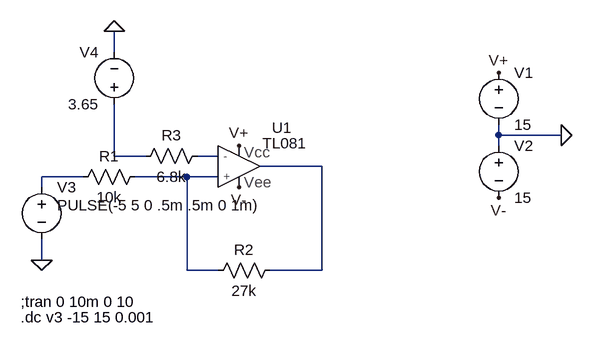
[diagram p0: schematic Biestable - schmitt trigger - NOINV.asc]
Biestable - schmitt trigger - NOINV.asc, the LTspice schematic file:
Version 4
SHEET 1 880 680
WIRE 16 -80 16 -112
WIRE 608 48 608 32
WIRE 704 48 608 48
WIRE 608 64 608 48
WIRE 16 80 16 0
WIRE 64 80 16 80
WIRE 176 80 144 80
WIRE 336 96 240 96
WIRE -32 112 -96 112
WIRE 128 112 48 112
WIRE 176 112 128 112
WIRE -96 128 -96 112
WIRE -96 240 -96 208
WIRE 128 256 128 112
WIRE 176 256 128 256
WIRE 336 256 336 96
WIRE 336 256 256 256
FLAG 208 128 V-
FLAG 704 48 0
FLAG 608 -48 V+
FLAG 608 144 V-
FLAG -96 240 0
FLAG 208 64 V+
FLAG 16 -112 0
SYMBOL Agregados\\TL081 208 96 R0
SYMATTR InstName U1
SYMBOL res 272 240 R90
WINDOW 0 0 56 VBottom 2
WINDOW 3 32 56 VTop 2
SYMATTR InstName R2
SYMATTR Value 27k
SYMBOL res 64 96 R90
WINDOW 0 0 56 VBottom 2
WINDOW 3 32 56 VTop 2
SYMATTR InstName R1
SYMATTR Value 10k
SYMBOL voltage 608 -64 R0
WINDOW 123 0 0 Left 0
WINDOW 39 0 0 Left 0
SYMATTR InstName V1
SYMATTR Value 15
SYMBOL voltage 608 48 R0
WINDOW 123 0 0 Left 0
WINDOW 39 0 0 Left 0
SYMATTR InstName V2
SYMATTR Value 15
SYMBOL voltage -96 112 R0
WINDOW 123 0 0 Left 0
WINDOW 39 0 0 Left 0
WINDOW 3 24 44 Left 2
SYMATTR Value PULSE(-5 5 0 .5m .5m 0 1m)
SYMATTR InstName V3
SYMBOL res 160 64 R90
WINDOW 0 0 56 VBottom 2
WINDOW 3 32 56 VTop 2
SYMATTR InstName R3
SYMATTR Value 6.8k
SYMBOL voltage 16 16 R180
WINDOW 0 24 96 Left 2
WINDOW 3 24 16 Left 2
WINDOW 123 0 0 Left 0
WINDOW 39 0 0 Left 0
SYMATTR InstName V4
SYMATTR Value 3.65
TEXT -128 304 Left 2 !;tran 0 10m 0 10
TEXT -128 328 Left 2 !.dc v3 -15 15 0.001

The netlist it stands for:
* Biestable - schmitt trigger - NOINV.asc
XU1 N005 N002 V+ V- N003 TL081  ; pins + - ? ? ?
R2 N003 N005 27k
R1 N005 N004 10k
V1 V+ 0 15
V2 0 V- 15
V3 N004 0 PULSE(-5 5 0 .5m .5m 0 1m)
R3 N002 N001 6.8k
V4 N001 0 3.65
;tran 0 10m 0 10
.dc v3 -15 15 0.001
.lib E:\Descargas\TL081.net
.backanno
.end